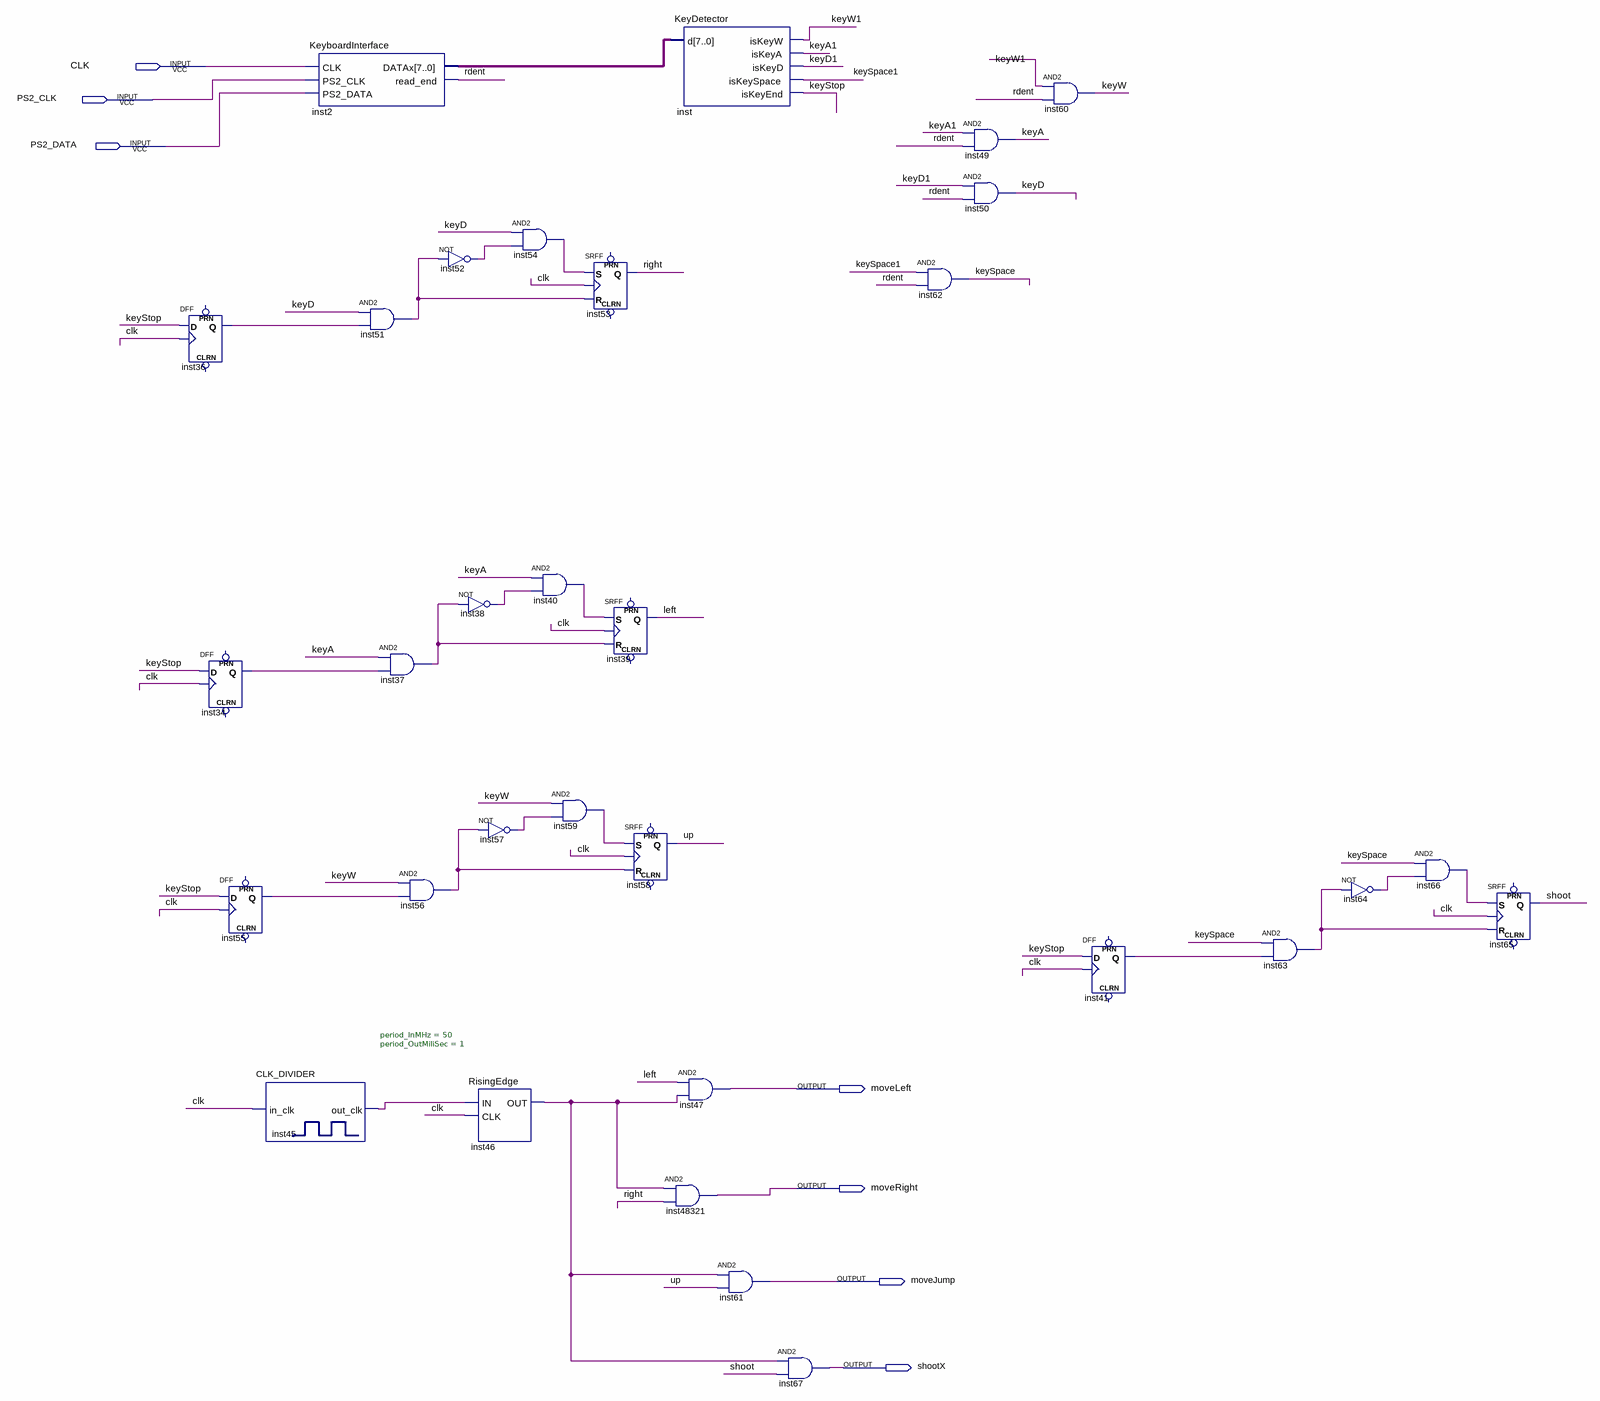
[diagram p0: schematic sheet]
// Quartus schematic MoveDetector.bdf as structural Verilog: 32 symbols, 7 pins
module MoveDetector (
  input  CLK,
  input  PS2_CLK,
  input  PS2_DATA,
  output moveLeft,
  output moveRight,
  output moveJump,
  output shootX
);

  wire inst34_q, inst36_q, inst37_out, inst38_out, inst40_out, inst41_q, inst45_out_clk, inst46_out,
       inst51_out, inst52_out, inst54_out, inst55_q, inst56_out, inst57_out, inst59_out, inst63_out,
       inst64_out, inst66_out, keyA, keyA1, keyD, keyD1, keySpace, keySpace1, keyStop, keyW, keyW1, left,
       rdent, right, shoot, up;
  wire [7:0] inst2_datax;

  DFF inst36 (.CLK(CLK), .D(keyStop), .Q(inst36_q));  // open: CLRN, PRN
  DFF inst34 (.CLK(CLK), .D(keyStop), .Q(inst34_q));  // open: CLRN, PRN
  DFF inst55 (.CLK(CLK), .D(keyStop), .Q(inst55_q));  // open: CLRN, PRN
  CLK_DIVIDER #(.period_InMHz(50), .period_OutMiliSec(1)) inst45 (.in_clk(CLK), .out_clk(inst45_out_clk));
  KeyboardInterface inst2 (.CLK(CLK), .PS2_CLK(PS2_CLK), .PS2_DATA(PS2_DATA), .DATAx(inst2_datax), .read_end(rdent));
  and inst51 (inst51_out, keyD, inst36_q);
  and inst37 (inst37_out, keyA, inst34_q);
  and inst56 (inst56_out, keyW, inst55_q);
  not inst52 (inst52_out, inst51_out);
  not inst38 (inst38_out, inst37_out);
  RisingEdge inst46 (.IN(inst45_out_clk), .CLK(CLK), .OUT(inst46_out));
  and inst54 (inst54_out, keyD, inst52_out);
  not inst57 (inst57_out, inst56_out);
  and inst40 (inst40_out, keyA, inst38_out);
  and inst59 (inst59_out, keyW, inst57_out);
  SRFF inst53 (.S(inst54_out), .R(inst51_out), .CLK(CLK), .Q(right));  // open: PRN, CLRN
  SRFF inst39 (.S(inst40_out), .R(inst37_out), .CLK(CLK), .Q(left));  // open: PRN, CLRN
  SRFF inst58 (.S(inst59_out), .R(inst56_out), .CLK(CLK), .Q(up));  // open: PRN, CLRN
  KeyDetector inst (
    .d(inst2_datax), .isKeyW(keyW1), .isKeyA(keyA1), .isKeyD(keyD1), .isKeySpace(keySpace1),
    .isKeyEnd(keyStop));
  and inst47 (moveLeft, left, inst46_out);
  and inst48321 (moveRight, inst46_out, right);
  and inst61 (moveJump, inst46_out, up);
  and inst67 (shootX, inst46_out, shoot);
  and inst62 (keySpace, keySpace1, rdent);
  and inst49 (keyA, keyA1, rdent);
  and inst50 (keyD, keyD1, rdent);
  and inst60 (keyW, keyW1, rdent);
  DFF inst41 (.CLK(CLK), .D(keyStop), .Q(inst41_q));  // open: CLRN, PRN
  and inst63 (inst63_out, keySpace, inst41_q);
  not inst64 (inst64_out, inst63_out);
  and inst66 (inst66_out, keySpace, inst64_out);
  SRFF inst65 (.S(inst66_out), .R(inst63_out), .CLK(CLK), .Q(shoot));  // open: PRN, CLRN
endmodule
